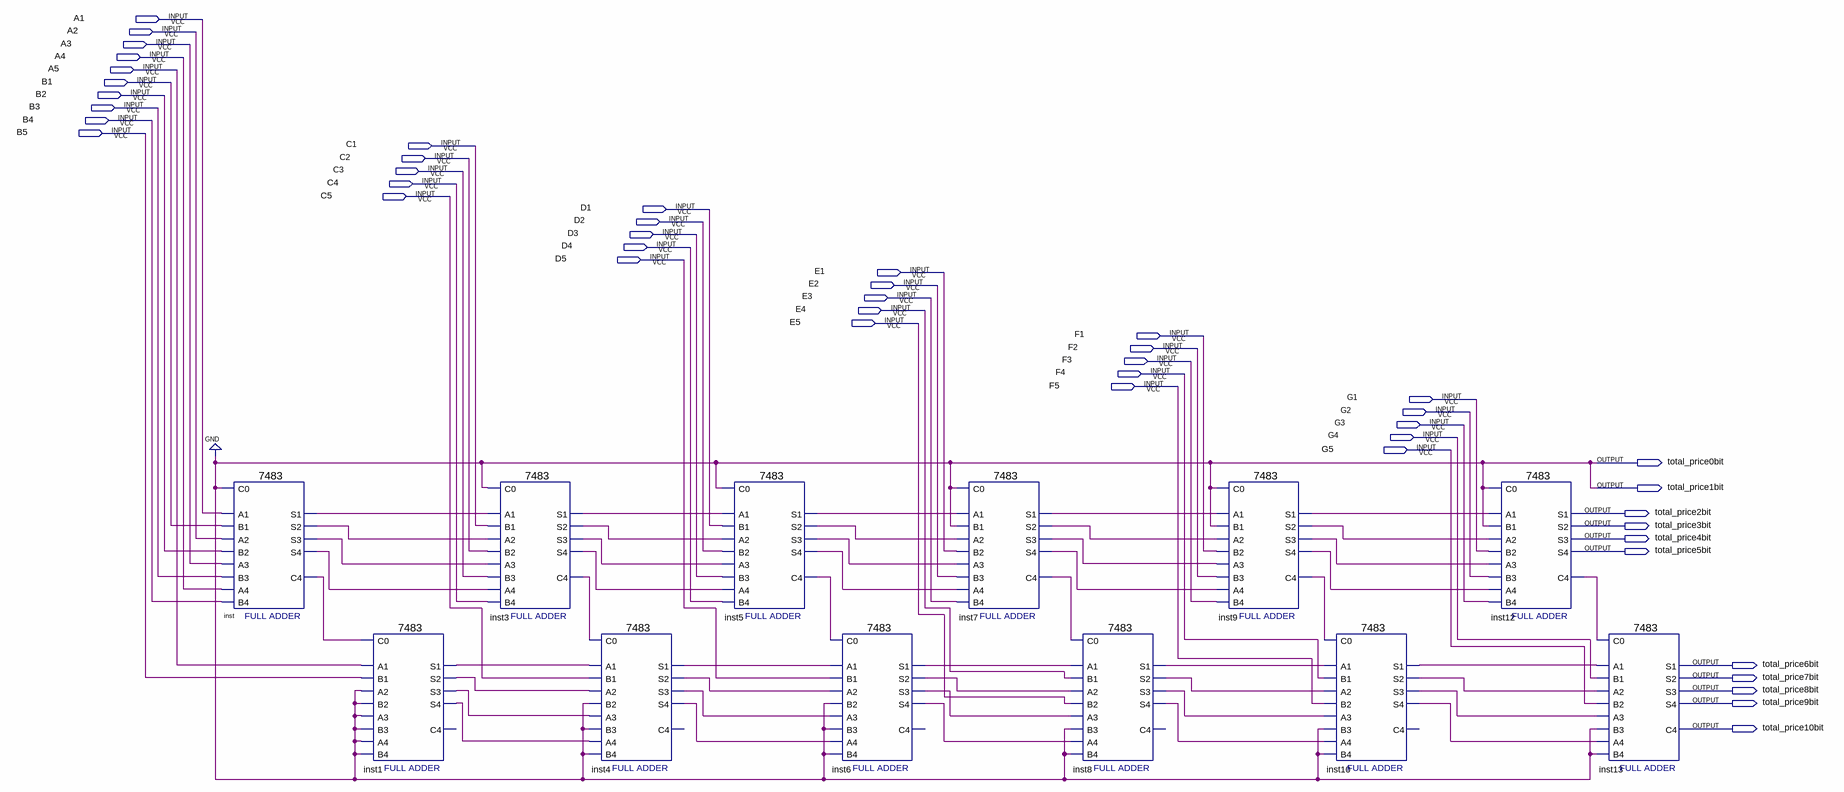
[diagram p0: schematic sheet]
// Quartus schematic total_price_calculator.bdf as structural Verilog: 12 symbols, 46 pins
module total_price_calculator (
  input  A1,
  input  A2,
  input  A3,
  input  A4,
  input  A5,
  input  B1,
  input  B2,
  input  B3,
  input  B4,
  input  B5,
  input  C1,
  input  C2,
  input  C3,
  input  C4,
  input  C5,
  input  D1,
  input  D2,
  input  D3,
  input  D4,
  input  D5,
  input  E1,
  input  E2,
  input  E3,
  input  E4,
  input  E5,
  input  F1,
  input  F2,
  input  F3,
  input  F4,
  input  F5,
  input  G1,
  input  G2,
  input  G3,
  input  G4,
  input  G5,
  output total_price0bit,
  output total_price1bit,
  output total_price2bit,
  output total_price3bit,
  output total_price4bit,
  output total_price5bit,
  output total_price6bit,
  output total_price7bit,
  output total_price8bit,
  output total_price9bit,
  output total_price10bit
);

  wire inst1_s1, inst1_s2, inst1_s3, inst1_s4, inst3_c4, inst3_s1, inst3_s2, inst3_s3, inst3_s4, inst4_s1,
       inst4_s2, inst4_s3, inst4_s4, inst5_c4, inst5_s1, inst5_s2, inst5_s3, inst5_s4, inst6_s1, inst6_s2,
       inst6_s3, inst6_s4, inst7_c4, inst7_s1, inst7_s2, inst7_s3, inst7_s4, inst8_s1, inst8_s2, inst8_s3,
       inst8_s4, inst9_c4, inst9_s1, inst9_s2, inst9_s3, inst9_s4, inst10_s1, inst10_s2, inst10_s3,
       inst10_s4, inst12_c4, inst_c4, inst_s1, inst_s2, inst_s3, inst_s4;

  \7483  inst (
    .B4(B4), .C0(1'b0), .A1(A1), .A2(A2), .B1(B1), .B2(B2), .A3(A3), .B3(B3), .A4(A4), .S3(inst_s3),
    .S4(inst_s4), .S2(inst_s2), .C4(inst_c4), .S1(inst_s1));
  \7483  inst1 (
    .B4(1'b0), .C0(inst_c4), .A1(A5), .A2(1'b0), .B1(B5), .B2(1'b0), .A3(1'b0), .B3(1'b0), .A4(1'b0),
    .S3(inst1_s3), .S4(inst1_s4), .S2(inst1_s2), .S1(inst1_s1));  // open: C4
  \7483  inst3 (
    .B4(C4), .C0(1'b0), .A1(inst_s1), .A2(inst_s2), .B1(C1), .B2(C2), .A3(inst_s3), .B3(C3), .A4(inst_s4),
    .S3(inst3_s3), .S4(inst3_s4), .S2(inst3_s2), .C4(inst3_c4), .S1(inst3_s1));
  \7483  inst4 (
    .B4(1'b0), .C0(inst3_c4), .A1(inst1_s1), .A2(inst1_s2), .B1(C5), .B2(1'b0), .A3(inst1_s3), .B3(1'b0),
    .A4(inst1_s4), .S3(inst4_s3), .S4(inst4_s4), .S2(inst4_s2), .S1(inst4_s1));  // open: C4
  \7483  inst5 (
    .B4(D4), .C0(1'b0), .A1(inst3_s1), .A2(inst3_s2), .B1(D1), .B2(D2), .A3(inst3_s3), .B3(D3),
    .A4(inst3_s4), .S3(inst5_s3), .S4(inst5_s4), .S2(inst5_s2), .C4(inst5_c4), .S1(inst5_s1));
  \7483  inst6 (
    .B4(1'b0), .C0(inst5_c4), .A1(inst4_s1), .A2(inst4_s2), .B1(D5), .B2(1'b0), .A3(inst4_s3), .B3(1'b0),
    .A4(inst4_s4), .S3(inst6_s3), .S4(inst6_s4), .S2(inst6_s2), .S1(inst6_s1));  // open: C4
  \7483  inst7 (
    .B4(E3), .C0(1'b0), .A1(inst5_s1), .A2(inst5_s2), .B1(1'b0), .B2(E1), .A3(inst5_s3), .B3(E2),
    .A4(inst5_s4), .S3(inst7_s3), .S4(inst7_s4), .S2(inst7_s2), .C4(inst7_c4), .S1(inst7_s1));
  \7483  inst8 (
    .B4(1'b0), .C0(inst7_c4), .A1(inst6_s1), .A2(inst6_s2), .B1(E4), .B2(E5), .A3(inst6_s3), .B3(1'b0),
    .A4(inst6_s4), .S3(inst8_s3), .S4(inst8_s4), .S2(inst8_s2), .S1(inst8_s1));  // open: C4
  \7483  inst9 (
    .B4(F3), .C0(1'b0), .A1(inst7_s1), .A2(inst7_s2), .B1(1'b0), .B2(F1), .A3(inst7_s3), .B3(F2),
    .A4(inst7_s4), .S3(inst9_s3), .S4(inst9_s4), .S2(inst9_s2), .C4(inst9_c4), .S1(inst9_s1));
  \7483  inst10 (
    .B4(1'b0), .C0(inst9_c4), .A1(inst8_s1), .A2(inst8_s2), .B1(F4), .B2(F5), .A3(inst8_s3), .B3(1'b0),
    .A4(inst8_s4), .S3(inst10_s3), .S4(inst10_s4), .S2(inst10_s2), .S1(inst10_s1));  // open: C4
  \7483  inst12 (
    .B4(G3), .C0(1'b0), .A1(inst9_s1), .A2(inst9_s2), .B1(1'b0), .B2(G1), .A3(inst9_s3), .B3(G2),
    .A4(inst9_s4), .S3(total_price4bit), .S4(total_price5bit), .S2(total_price3bit), .C4(inst12_c4),
    .S1(total_price2bit));
  \7483  inst13 (
    .B4(1'b0), .C0(inst12_c4), .A1(inst10_s1), .A2(inst10_s2), .B1(G4), .B2(G5), .A3(inst10_s3), .B3(1'b0),
    .A4(inst10_s4), .S3(total_price8bit), .S4(total_price9bit), .S2(total_price7bit), .C4(total_price10bit),
    .S1(total_price6bit));

  assign total_price0bit = 1'b0;
  assign total_price1bit = 1'b0;
endmodule
